# EasyEDA schematic SCH_Linefollowerv1_2022-11-18.json
TITLE: Linefollower Yanco, Senne, Louis, Jens, Lucas; REV: 1.0; Date: 2022-10-18; Sheet: 1/1; Company: Hogent
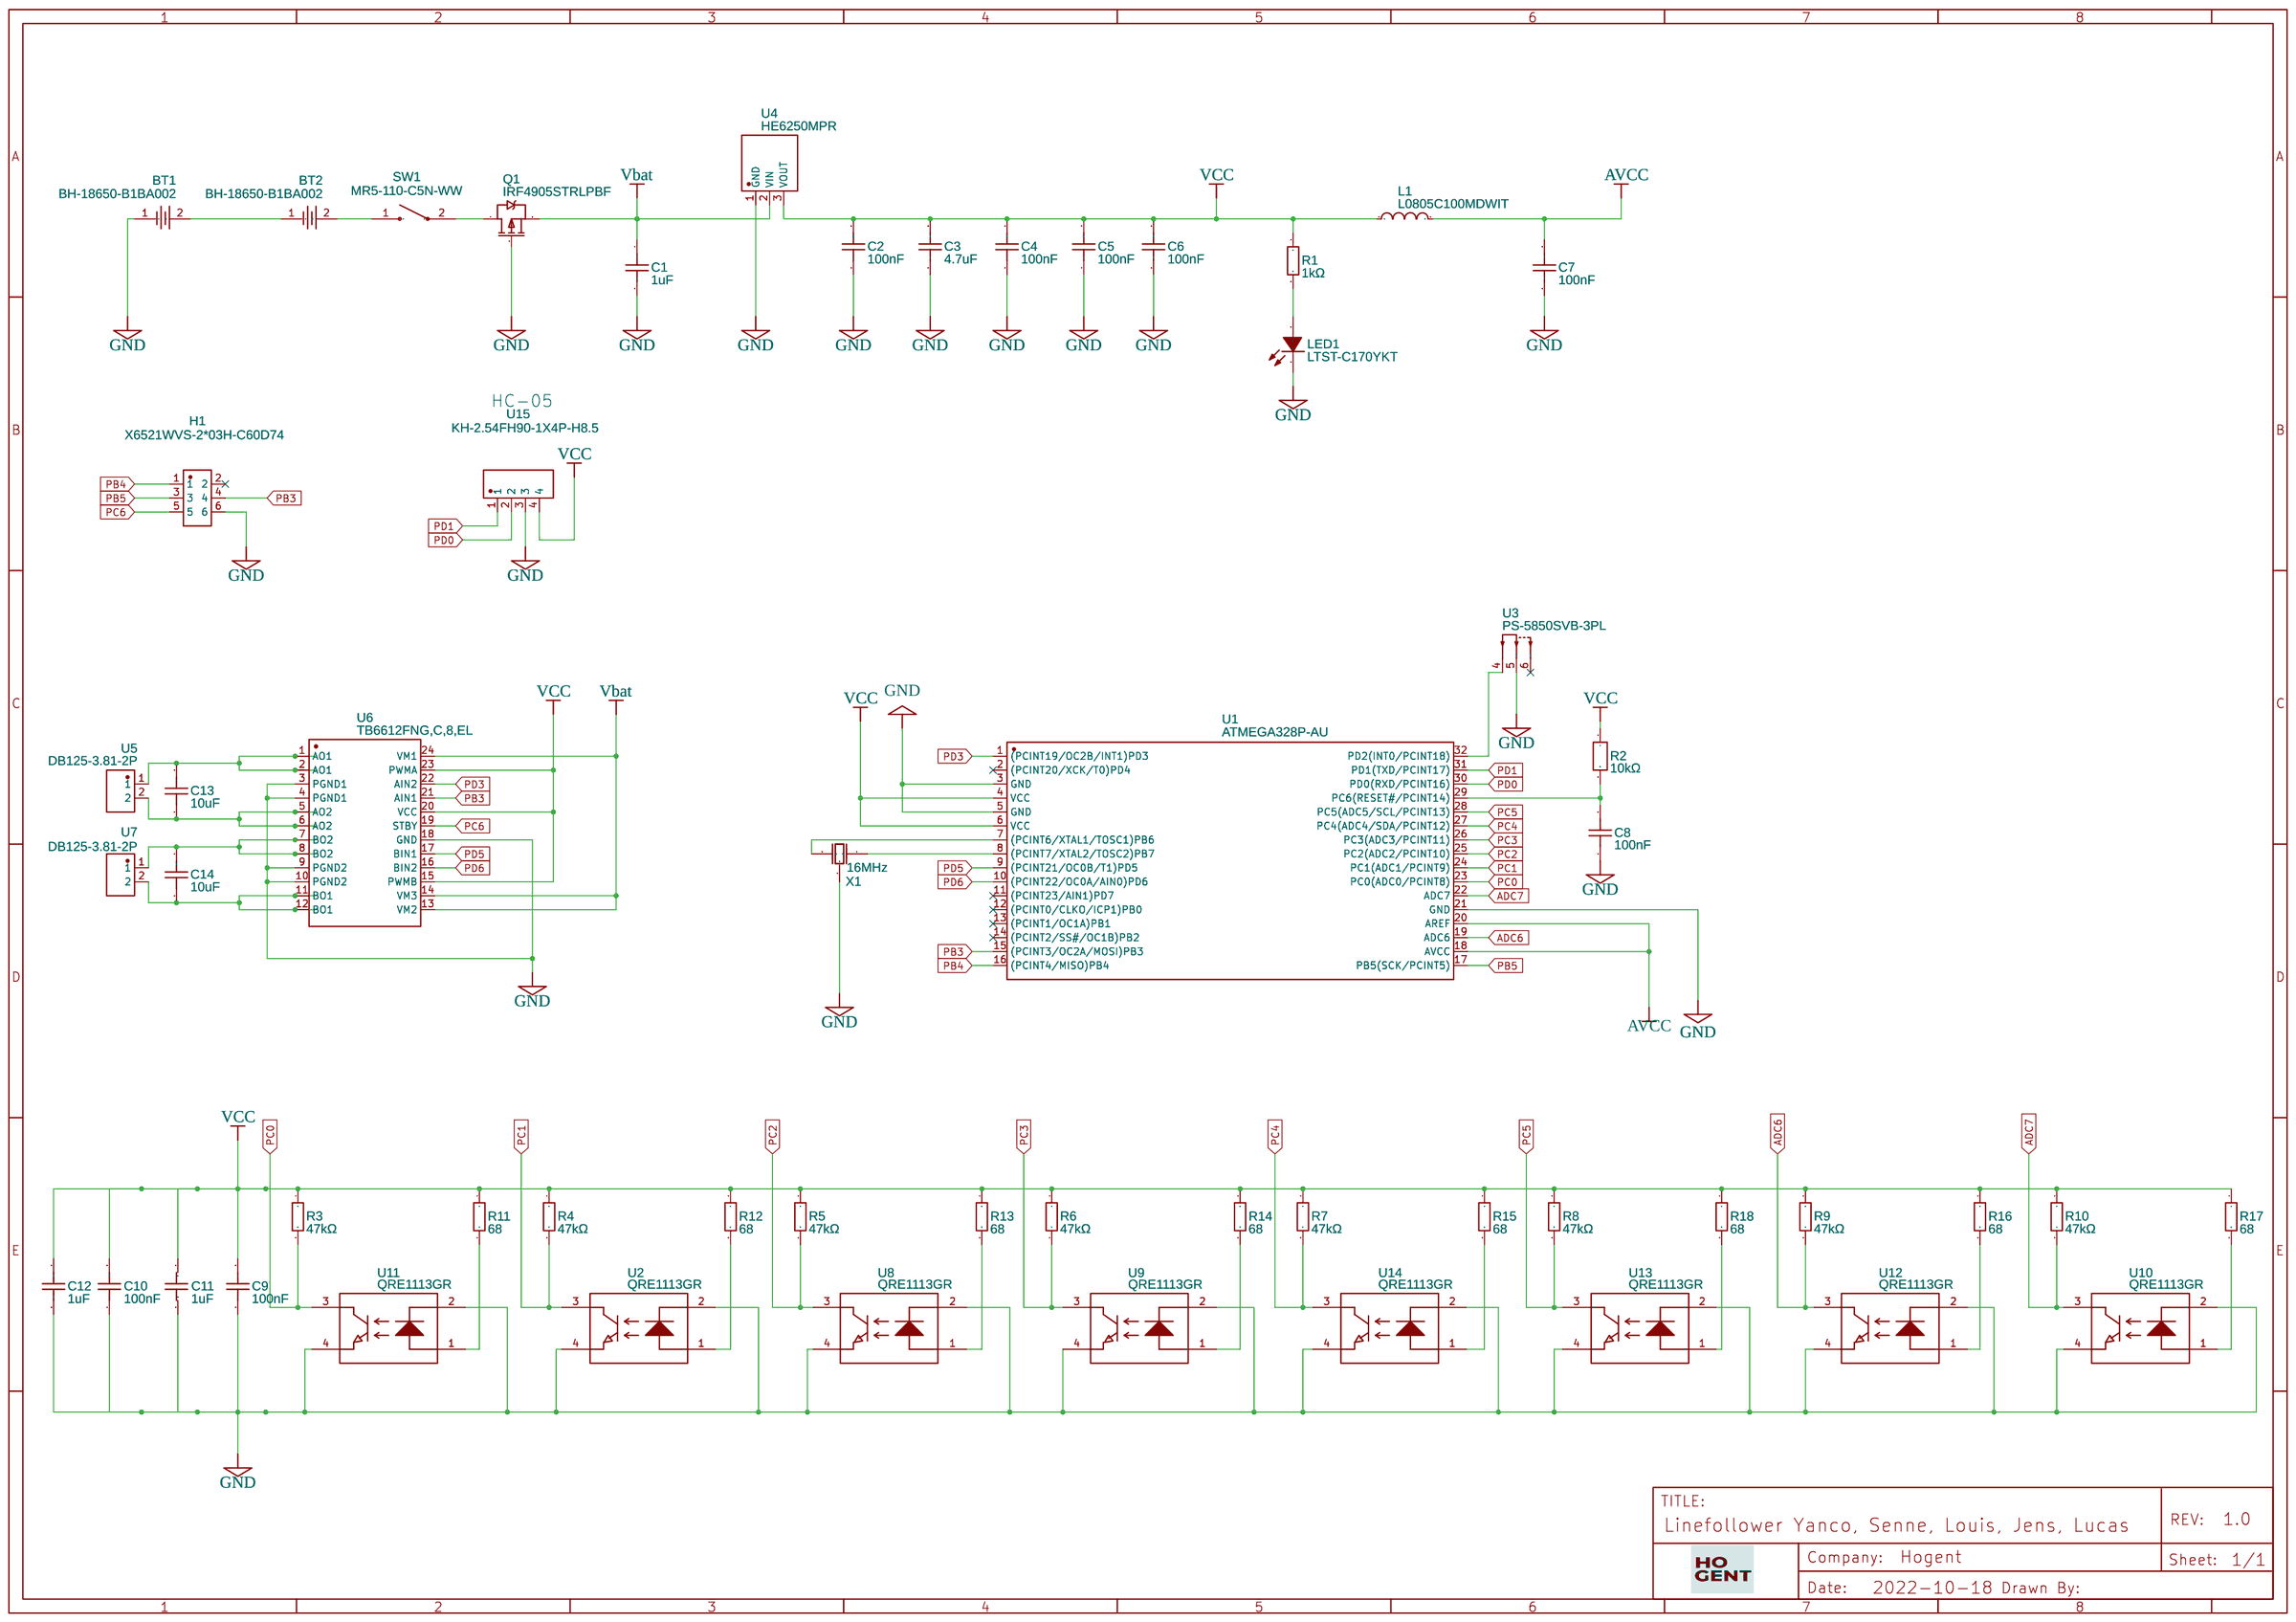
[diagram p0: schematic sheet]

## Parts
BT1  BH-18650-B1BA002  [BATTERY-SMD_18650-1S-L77.1-W20.7-1]
BT2  BH-18650-B1BA002  [BATTERY-SMD_18650-1S-L77.1-W20.7-1]
C1  1uF  [C0805]
C2  100nF  [C0805]
C3  4.7uF  [C0805]
C4  100nF  [C0805]
C5  100nF  [C0805]
C6  100nF  [C0805]
C7  100nF  [C0805]
C8  100nF  [C0805]
C9  100nF  [C0805]
C10  100nF  [C0805]
C11  1uF  [C0805]
C12  1uF  [C0805]
C13  10uF  [C0805]
C14  10uF  [C0805]
H1  X6521WVS-2*03H-C60D74  [HDR-SMD_6P-P2.54-V-M-R2-C5-S7.4]
L1  L0805C100MDWIT  [L2012]
LED1  LTST-C170YKT  [LED0805-RD_YELLOW]
Q1  IRF4905STRLPBF  [D2PAK_L9.1-W10.0-P2.54-LS15.3-TL]
R1  1kΩ  [R0805]
R2  10kΩ  [R0805]
R3  47kΩ  [R0805]
R4  47kΩ  [R0805]
R5  47kΩ  [R0805]
R6  47kΩ  [R0805]
R7  47kΩ  [R0805]
R8  47kΩ  [R0805]
R9  47kΩ  [R0805]
R10  47kΩ  [R0805]
R11  68  [R0805]
R12  68  [R0805]
R13  68  [R0805]
R14  68  [R0805]
R15  68  [R0805]
R16  68  [R0805]
R17  68  [R0805]
R18  68  [R0805]
SW1  MR5-110-C5N-WW  [SW-TH_MR5-111-C5N-BB]
U1  ATMEGA328P-AU  [TQFP-32_L7.0-W7.0-P0.80-LS9.0-BL]
U2  QRE1113GR  [OPTO-SMD_QRE1113GR]
U3  PS-5850SVB-3PL  [SW-SMD_G-SWITCH_PS-5850SVX-3PL]
U4  HE6250MPR  [SOT-89-3_L4.5-W2.5-P1.50-LS4.2-BR]
U5  DB125-3.81-2P  [CONN-TH_2P-P3.81_L7.4-W7.6]
U6  TB6612FNG,C,8,EL  [SSOP24-0.65-8.9X5.3MM]
U7  DB125-3.81-2P  [CONN-TH_2P-P3.81_L7.4-W7.6]
U8  QRE1113GR  [OPTO-SMD_QRE1113GR]
U9  QRE1113GR  [OPTO-SMD_QRE1113GR]
U10  QRE1113GR  [OPTO-SMD_QRE1113GR]
U11  QRE1113GR  [OPTO-SMD_QRE1113GR]
U12  QRE1113GR  [OPTO-SMD_QRE1113GR]
U13  QRE1113GR  [OPTO-SMD_QRE1113GR]
U14  QRE1113GR  [OPTO-SMD_QRE1113GR]
U15  KH-2.54FH90-1X4P-H8.5  [HDR-TH_4P-P2.54-H-F-W10.2]
X1  16MHz  [OSC-SMD_3P-L3.2-W1.3-P1.20-L]

## Library data of the parts
BT1 BT2 = BH-18650-B1BA002: Supplier: LCSC; Supplier Part: C2988620; Manufacturer: MYOUNG(美阳); link: https://atta.szlcsc.com/upload/public/pdf/source/20220402/870DB99AB50CA0DF8D51CF7C86A51FAB.pdf; Contributor: lcsc; JLCPCB Part Class: Extended Part
C1 C11 C12 = LMK212BJ105KD-T: Supplier: LCSC; Manufacturer: TAIYO YUDEN; Supplier Part: C92812; JLCPCB Part Class: Extended Part
C2 C4-C10 = LMK212SD104KG-T: Supplier: LCSC; Supplier Part: C386062; Manufacturer: Taiyo Yuden; Contributor: LCSC; JLCPCB Part Class: Extended Part
C3 = GCM21BC71A475KA73L: Supplier: LCSC; Supplier Part: C126583; Manufacturer: Murata Electronics; Contributor: LCSC; JLCPCB Part Class: Extended Part
C13 C14 = LMK212BJ106KD-T: Supplier: LCSC; Manufacturer: TAIYO YUDEN; Supplier Part: C89143; JLCPCB Part Class: Extended Part
H1 = X6521WVS-2*03H-C60D74: Supplier: LCSC; Supplier Part: C780054; Manufacturer: XKB Connectivity; Contributor: LCSC; JLCPCB Part Class: Extended Part
L1 = L0805C100MDWIT: Supplier: LCSC; Supplier Part: C696787; Manufacturer: KEMET; Contributor: LCSC; JLCPCB Part Class: Extended Part
LED1 = LTST-C170YKT: Supplier: LCSC; Supplier Part: C125092; Manufacturer: Lite-On; Contributor: LCSC; JLCPCB Part Class: Extended Part
Q1 = IRF4905STRLPBF: Supplier: LCSC; Manufacturer: IR; Supplier Part: C2620; JLCPCB Part Class: Extended Part
R1 = ARG05BTC1001: Supplier: LCSC; Supplier Part: C309081; Manufacturer: Viking Tech; Resistance (Ohms): 1K; Contributor: LCSC; JLCPCB Part Class: Extended Part
R2 = ARG05BTC1002: Supplier: LCSC; Supplier Part: C406725; Manufacturer: Viking Tech; Resistance (Ohms): 10K; Contributor: LCSC; JLCPCB Part Class: Extended Part
R3-R10 = AECR0805F47K0K9: Supplier: LCSC; Supplier Part: C328397; Manufacturer: ResistorToday; Resistance (Ohms): 47K; Contributor: LCSC; JLCPCB Part Class: Extended Part
R11-R18 = RC0805FR-0768RL: Supplier: LCSC; Manufacturer: YAGEO; Supplier Part: C137498; JLCPCB Part Class: Extended Part; Resistance: 68Ω
SW1 = MR5-110-C5N-WW: Supplier: LCSC; Supplier Part: C2829507; Manufacturer: D-SWITCH(德崧); link: https://atta.szlcsc.com/upload/public/pdf/source/20210520/C2829507_EE0D014B7885C7638583C3435B0A3A1D.pdf; Contributor: lcsc
U1 = ATMEGA328P-AU: Supplier: LCSC; Manufacturer: MICROCHIP; Supplier Part: C14877; JLCPCB Part Class: Basic Part
U2 U8-U14 = QRE1113GR: Supplier: LCSC; Supplier Part: C232862; Manufacturer: ON Semicon; Contributor: LCSC; JLCPCB Part Class: Extended Part
U3 = PS-5850SVB-3PL: Supplier: LCSC; Supplier Part: C5159077; Manufacturer: G-Switch(品赞); link: https://atta.szlcsc.com/upload/public/pdf/source/20220908/F0FBE517B48B2A340E358FF45F837DBD.pdf; Contributor: lcsc
U4 = HE6250MPR: Supplier: LCSC; Supplier Part: C711940; Manufacturer: HEERMICR; Contributor: LCSC; JLCPCB Part Class: Extended Part
U5 U7 = DB125-3.81-2P: Supplier: LCSC; Supplier Part: C395878; Manufacturer: DIBO; Contributor: LCSC; JLCPCB Part Class: Extended Part
U6 = -: Supplier: LCSC; Manufacturer: TOSHIBA; Contributor: LCSC; Supplier Part: C141517
U15 = KH-2.54FH90-1X4P-H8.5: Supplier: LCSC; Supplier Part: C2932680; Manufacturer: kinghelm(金航标); Contributor: LCSC; JLCPCB Part Class: Extended Part
X1 = CSTNE16M0V53C000R0: Supplier: LCSC; Supplier Part: C882606; Manufacturer: muRata(村田); Contributor: LCSC; JLCPCB Part Class: Extended Part

## Nets
AVCC: C7.2 L1.2 U1.18(AVCC) U1.20(AREF)
GND: BT1.1 C1.2 C2.1 C3.1 C4.1 C5.1 C6.1 C7.1 C8.1 C9.1 C10.1 C11.2 C12.2 H1.6 LED1.1 Q1.1(G) U1.3(GND) U1.5(GND) U1.21(GND) U2.2 U2.4 U3.5 U4.1(GND) U6.3(PGND1) U6.4(PGND1) U6.9(PGND2) U6.10(PGND2) U6.18(GND) U8.2 U8.4 U9.2 U9.4 U10.2 U10.4 U11.2 U11.4 U12.2 U12.4 U13.2 U13.4 U14.2 U14.4 U15.3 X1.2(GND)
Vbat: C1.1 Q1.3(S) U4.2(VIN) U6.13(VM2) U6.14(VM3) U6.24(VM1)
VCC: C2.2 C3.2 C4.2 C5.2 C6.2 C9.2 C10.2 C11.1 C12.1 L1.1 R1.1 R2.1 R3.1 R4.1 R5.1 R6.1 R7.1 R8.1 R9.1 R10.1 R11.1 R12.1 R13.1 R14.1 R15.1 R16.1 R17.1 R18.1 U1.4(VCC) U1.6(VCC) U4.3(VOUT) U6.15(PWMB) U6.20(VCC) U6.23(PWMA) U15.4
ADC6: R9.2 U1.19(ADC6) U12.3
ADC7: R10.2 U1.22(ADC7) U10.3
PB3: H1.4 U1.15((PCINT3/OC2A/MOSI)PB3) U6.21(AIN1)
PB4: H1.1 U1.16((PCINT4/MISO)PB4)
PB5: H1.3 U1.17(PB5(SCK/PCINT5))
PC0: R3.2 U1.23(PC0(ADC0/PCINT8)) U11.3
PC1: R4.2 U1.24(PC1(ADC1/PCINT9)) U2.3
PC2: R5.2 U1.25(PC2(ADC2/PCINT10)) U8.3
PC3: R6.2 U1.26(PC3(ADC3/PCINT11)) U9.3
PC4: R7.2 U1.27(PC4(ADC4/SDA/PCINT12)) U14.3
PC5: R8.2 U1.28(PC5(ADC5/SCL/PCINT13)) U13.3
PC6: H1.5 U6.19(STBY)
PD0: U1.30(PD0(RXD/PCINT16)) U15.2
PD1: U1.31(PD1(TXD/PCINT17)) U15.1
PD3: U1.1((PCINT19/OC2B/INT1)PD3) U6.22(AIN2)
PD5: U1.9((PCINT21/OC0B/T1)PD5) U6.17(BIN1)
PD6: U1.10((PCINT22/OC0A/AIN0)PD6) U6.16(BIN2)
Net-(BT1-2): BT1.2 BT2.1
Net-(BT2-2): BT2.2 SW1.1
Net-(C8-2): C8.2 R2.2 U1.29(PC6(RESET#/PCINT14))
Net-(C13-1): C13.1 U5.2 U6.5(AO2) U6.6(AO2)
Net-(C13-2): C13.2 U5.1 U6.1(AO1) U6.2(AO1)
Net-(C14-1): C14.1 U6.11(BO1) U6.12(BO1) U7.2
Net-(C14-2): C14.2 U6.7(BO2) U6.8(BO2) U7.1
Net-(LED1-2): LED1.2 R1.2
Net-(Q1-4): Q1.4(D) SW1.2
Net-(R11-2): R11.2 U11.1
Net-(R12-2): R12.2 U2.1
Net-(R13-2): R13.2 U8.1
Net-(R14-2): R14.2 U9.1
Net-(R15-2): R15.2 U14.1
Net-(R16-2): R16.2 U12.1
Net-(R17-2): R17.2 U10.1
Net-(R18-2): R18.2 U13.1
Net-(U1-7): U1.7((PCINT6/XTAL1/TOSC1)PB6) X1.3(OSC2)
Net-(U1-8): U1.8((PCINT7/XTAL2/TOSC2)PB7) X1.1(OSC1)
Net-(U1-32): U1.32(PD2(INT0/PCINT18)) U3.4

Not connected (* = marked no-connect by the designer): H1 2*; U1 2((PCINT20/XCK/T0)PD4)* 11((PCINT23/AIN1)PD7)* 12((PCINT0/CLKO/ICP1)PB0)* 13((PCINT1/OC1A)PB1)* 14((PCINT2/SS#/OC1B)PB2)*; U3 6*

## Notes on the sheet
- HC-05
